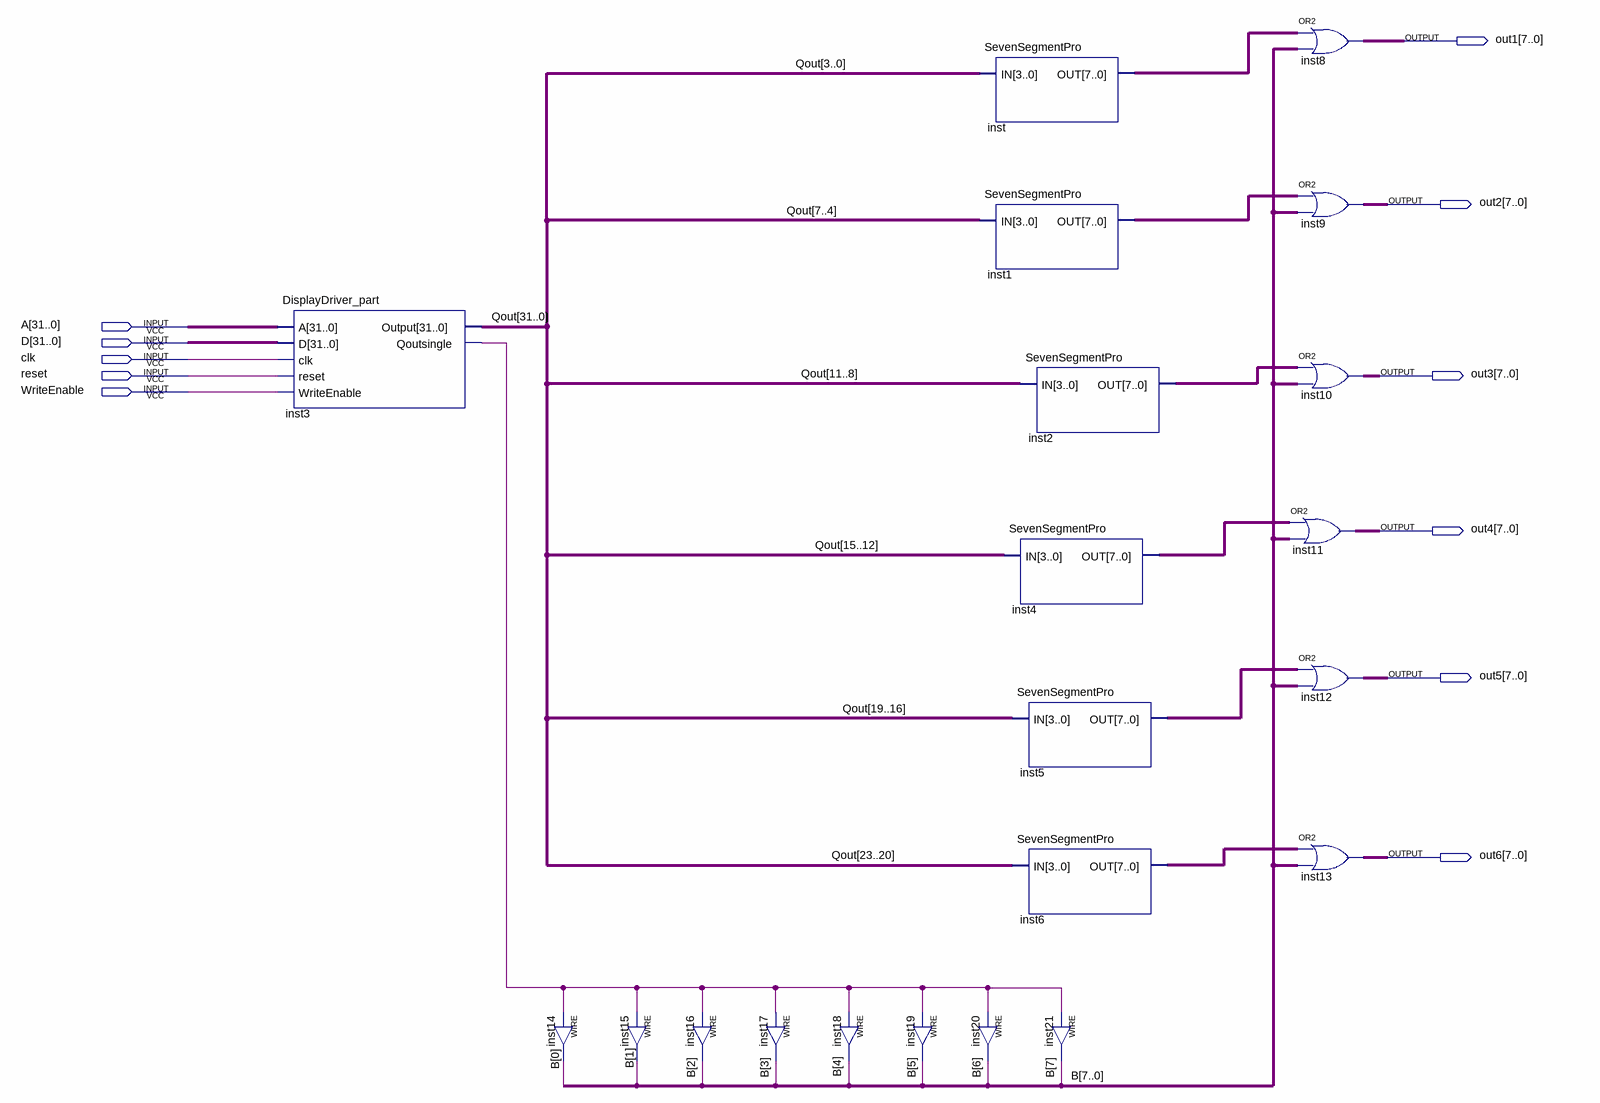
[diagram p0: schematic sheet]
// Quartus schematic displaydriverfull.bdf as structural Verilog: 21 symbols, 11 pins
module displaydriverfull (
  input  [31:0] A,
  input  [31:0] D,
  input  clk,
  input  reset,
  input  WriteEnable,
  output [7:0] out1,
  output [7:0] out2,
  output [7:0] out3,
  output [7:0] out4,
  output [7:0] out5,
  output [7:0] out6
);

  wire inst3_qoutsingle;
  wire [7:0] B, inst1_out, inst2_out, inst4_out, inst5_out, inst6_out, inst_out;
  wire [31:0] Qout;

  DisplayDriver_part inst3 (
    .A(A), .D(D), .clk(clk), .reset(reset), .WriteEnable(WriteEnable), .Output(Qout),
    .Qoutsingle(inst3_qoutsingle));
  assign B[0] = inst3_qoutsingle;  // WIRE inst14
  assign B[1] = inst3_qoutsingle;  // WIRE inst15
  assign B[2] = inst3_qoutsingle;  // WIRE inst16
  assign B[3] = inst3_qoutsingle;  // WIRE inst17
  assign B[4] = inst3_qoutsingle;  // WIRE inst18
  assign B[5] = inst3_qoutsingle;  // WIRE inst19
  SevenSegmentPro inst (.IN(Qout[3:0]), .OUT(inst_out));
  SevenSegmentPro inst1 (.IN(Qout[7:4]), .OUT(inst1_out));
  SevenSegmentPro inst2 (.IN(Qout[11:8]), .OUT(inst2_out));
  SevenSegmentPro inst4 (.IN(Qout[15:12]), .OUT(inst4_out));
  SevenSegmentPro inst5 (.IN(Qout[19:16]), .OUT(inst5_out));
  SevenSegmentPro inst6 (.IN(Qout[23:20]), .OUT(inst6_out));
  assign B[6] = inst3_qoutsingle;  // WIRE inst20
  assign B[7] = inst3_qoutsingle;  // WIRE inst21
  assign out1 = inst_out | B;  // OR2 inst8, 8 bits wide
  assign out2 = inst1_out | B;  // OR2 inst9, 8 bits wide
  assign out3 = inst2_out | B;  // OR2 inst10, 8 bits wide
  assign out4 = inst4_out | B;  // OR2 inst11, 8 bits wide
  assign out5 = inst5_out | B;  // OR2 inst12, 8 bits wide
  assign out6 = inst6_out | B;  // OR2 inst13, 8 bits wide
endmodule
